# Altium schematic sheet Power.SchDoc: Krapong-ROV, F-Tube (Power)
size A4; Author: Siwakorn Sukprasertchai; Engineer: Siwakorn Sukprasertchai; Organization: Author:; Address1: Siwakorn Sukprasertchai; Address3: Electrical Laboratory; Address4: IMS, KU SRC; DocumentNumber: 2; Revision: 1.0; SheetNumber: 1; SheetTotal: 4; PageSetup: Record=PageOptions|CenterHorizontal=True|CenterVertical=True|PrintScale=0.97|XCorrection=1.00|YCorrection=1.00|PrintKind=0|BorderSize=5000000|LeftOffset=0|BottomOffset=0|Orientation=2|PaperLength=1000|PaperWidth=1000|Scale=100|PaperSource=7|PrintQuality=-3|MediaType=1|DitherType=10|PrintScaleMode=1|PaperKind=A4|PaperIndex=9
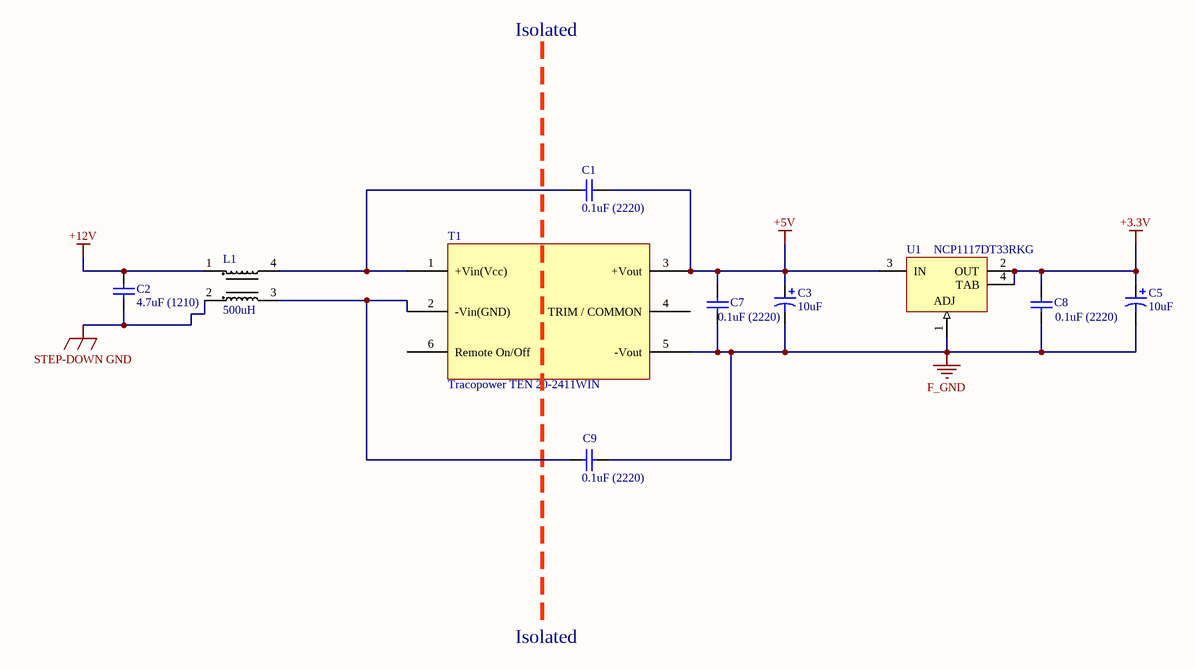
[diagram p0: Power.SchDoc]

## Parts
C1  0.1uF (2220)  [PCB-vinf2si7ml1r5i2zfsci-1]
C2  4.7uF (1210)  [PCB-2fbb0vau3p468w0y920g-1]
C3  10uF  [PCB-ibkib54e90xysjsqnert-1]
C5  10uF  [PCB-ibkib54e90xysjsqnert-1]
C7  0.1uF (2220)  [PCB-vinf2si7ml1r5i2zfsci-1]
C8  0.1uF (2220)  [PCB-vinf2si7ml1r5i2zfsci-1]
C9  0.1uF (2220)  [PCB-vinf2si7ml1r5i2zfsci-1]
L1  500uH  [PCB-kl08ucybfpyhun58dexm-1]
T1  Tracopower TEN 20-2411WIN  [PCBComponent_1]
U1  NCP1117DT33RKG  [PCB-1493942-1]

## Nets
+3.3V: C5.1 C8.1 U1.2(OUT) U1.4(TAB)
+5V: C1.1 C3.1 C7.1 T1.3(+Vout) U1.3(IN)
+12V: C2.2 L1.1
F_GND: C3.2 C5.2 C7.2 C8.2 C9.1 T1.5(-Vout) U1.1(ADJ)
STEP-DOWN GND: C2.1 L1.2
NetC1_2: C1.2 L1.4 T1.1(+Vin(Vcc))
NetC9_2: C9.2 L1.3 T1.2(-Vin(GND))

Not connected (* = marked no-connect by the designer): T1 4(TRIM_/_COMMON) 6(Remote_On/Off)

## Notes on the sheet
- Isolated
- Title
- Size:
- Date:
- A4
- Number:
- Time:
- Revision:
- Sheet
- of
- Designer:
- Siwakorn Sukprasertchai
- Marine Electrical Laboratory
- IMS, KU SRC
- File:

## Library data of the parts
C1 C7-C9 = CMP-869a4f93a212595d-3: 2220 1 uF 250 V ±10% Tolerance X7R SMT Multilayer Ceramic Capacitor; Manufacturer Part Number: GRM55DR72E105KW01L; Voltage Rating (DC): 250.0 V; Capacitance: 1e-06 F; Lead-Free Status: Lead Free; Mounting Style: Surface Mount; Dielectric Characteristic: X7R; Number of Pins: 2; Digikey URL: http://www.digikey.com/product-detail/en/murata-electronics-north-america/GRM55DR72E105KW01L/490-3550-1-ND/789455; Size-Width: 0.005 m; Case/Package: 2220, 5750; REACH SVHC Compliance: No SVHC; Size-Height: 0.002 m; Packaging: Cut Tape (CT), Tape & Reel (TR); Capacitance Tolerance: ±10%; RoHS: Compliant; OctopartID: 869a4f93a212595d; Size-Length: 0.0057 m; Octopart URL: http://octopart.com/grm55dr72e105kw01l-murata-197102
C2 = Murata GRM32ER71H475KA88L-1: 1210 4.7 uF 50 V ±10% Tolerance X7R SMT Multilayer Ceramic Capacitor; Voltage Rating (DC): 50.0 V; Lead-Free Status: Lead Free; Capacitance: 4.7e-06 F; Case/Package (SI): 3225; Octopart URL: http://octopart.com/grm32er71h475ka88l-murata-196576; Manufacturer Part Number: GRM32ER71H475KA88L; Size-Height: 0.0025 m; Dielectric Characteristic: X7R; Size-Width: 0.0025 m; RoHS: Compliant; REACH SVHC Compliance: No SVHC; Mounting Style: Surface Mount; Capacitance Tolerance: ±10%; Packaging: Cut Tape (CT), Tape & Reel (TR); Size-Length: 0.0032 m; Size-Thickness: 0.0025 m; Lifecycle Status: Active; Case/Package: 1210; Number of Pins: 2; OctopartID: 8d884480570e524f
C3 C5 = CMP-da8810cd3d6e054f-2: Capacitor Alum Elec, 10uf, 100v, 20%, Capacitor Alum Elec, 10uf, 100v, 20%, Smd, Full Reel; Manufacturer Part Number: EEE-2AA100UP; Capacitance: 10.0 µF; Lead-Free Status: Lead Free; RoHS: Compliant; Octopart URL: http://octopart.com/eee-2aa100up-panasonic-55558784; Lifecycle Status: Not Listed by Manufacturer; Capacitance Tolerance: ±20%; Packaging: Cut Tape (CT); Mounting Style: Surface Mount; Size-Height: 6.20 mm; Voltage Rating (DC): 100 V; REACH SVHC Compliance: No SVHC; Size-Diameter: 8.00 mm; OctopartID: da8810cd3d6e054f
L1 = CMP-c51a0edc807c1add-4: Common Mode Chokes Dual 1mH 10kHz 15A 3.3mOhm DCR Thru-Hole T/R; Manufacturer Part Number: 7448031501; Inductance: 1.00 mH; RoHS: Compliant; REACH SVHC Compliance: No SVHC; Mounting Style: Through Hole; Packaging: Bulk
T1 = CMP-cff406adefdb1033-7: 20 W Watt, 9-36VDCVin, Quad Output, 5V@4A General Purpose DC-DC Converter in standard 1 x 2; Isolation Voltage: 1.50 kV; Output Voltage: 5.00 V; Supply Voltage (DC): 24.0 V; Power Rating: 20.0 W; Number of Outputs: 1; Input Voltage (DC): 9.00 V to 36.0 V; Output Current: 4.00 A; Size-Width: 25.4 mm; Octopart URL: http://octopart.com/ten+20-2411win-tracopower-5440841; Manufacturer Part Number: TEN 20-2411WIN; OctopartID: cff406adefdb1033; Size-Height: 10.2 mm; REACH SVHC Compliance: No SVHC; Mounting Style: Through Hole; RoHS: Compliant
U1 = CMP-1493942-4: IC REG LDO 3.3V 1A DPAK; Current Rating: 1.0 A; Dropout Voltage: 1.2 V; Polarity: P-Channel; Number of Outputs: 1; Lead-Free Status: Lead Free; Mounting Style: Surface Mount; RoHS: Compliant; Octopart Url: https://octopart.com/ncp1117dt33rkg-on+semiconductor-538097; Case/Package: DPAK; OctopartID: 07a0cea21737d867; REACH SVHC Compliance: No SVHC; Lifecycle Status: Active; Number of Pins: 3; Packaging: Cut Tape (CT); Output Voltage: 3.3 V; Output Current: 1.0 A; Halogen Free Status: Halogen Free